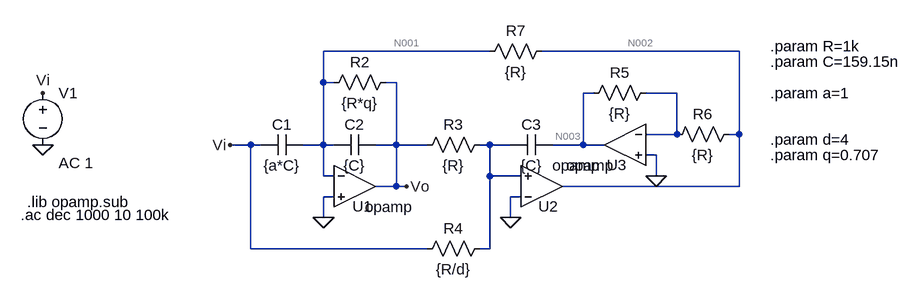
[diagram p0: schematic notch_ack.asc]
notch_ack.asc, the LTspice schematic file:
Version 4
SHEET 1 1316 680
WIRE 576 64 320 64
WIRE 960 64 656 64
WIRE 320 112 320 64
WIRE 336 112 320 112
WIRE 432 112 416 112
WIRE 736 128 720 128
WIRE 864 128 816 128
WIRE 864 192 864 128
WIRE 864 192 816 192
WIRE 960 192 960 64
WIRE 960 192 944 192
WIRE 208 208 176 208
WIRE 224 208 208 208
WIRE 320 208 320 112
WIRE 320 208 288 208
WIRE 336 208 320 208
WIRE 432 208 432 112
WIRE 432 208 400 208
WIRE 480 208 432 208
WIRE 576 208 560 208
WIRE 608 208 576 208
WIRE 720 208 720 128
WIRE 720 208 672 208
WIRE 752 208 720 208
WIRE 832 224 816 224
WIRE 320 256 320 208
WIRE 336 256 320 256
WIRE 576 256 576 208
WIRE 624 256 576 256
WIRE 832 256 832 224
WIRE 432 272 432 208
WIRE 432 272 400 272
WIRE 448 272 432 272
WIRE 960 272 960 192
WIRE 960 272 688 272
WIRE 336 288 320 288
WIRE 624 288 608 288
WIRE 320 320 320 288
WIRE 608 320 608 288
WIRE 208 368 208 208
WIRE 480 368 208 368
WIRE 576 368 576 256
WIRE 576 368 560 368
FLAG -112 128 Vi
FLAG -112 208 0
FLAG 176 208 Vi
FLAG 320 320 0
FLAG 608 320 0
FLAG 832 256 0
FLAG 448 272 Vo
SYMBOL voltage -112 112 R0
WINDOW 123 24 124 Left 2
WINDOW 39 0 0 Left 0
SYMATTR InstName V1
SYMATTR Value ""
SYMATTR Value2 AC 1
SYMBOL cap 288 192 R90
WINDOW 0 0 32 VBottom 2
WINDOW 3 32 32 VTop 2
SYMATTR InstName C1
SYMATTR Value {a*C}
SYMBOL OpAmps\\opamp 368 208 R0
WINDOW 0 -3 95 Left 2
SYMATTR InstName U1
SYMATTR SpiceLine Aol=1000K
SYMATTR SpiceLine2 GBW=100Meg
SYMBOL res 432 96 R90
WINDOW 0 0 56 VBottom 2
WINDOW 3 32 56 VTop 2
SYMATTR InstName R2
SYMATTR Value {R*q}
SYMBOL cap 400 192 R90
WINDOW 0 0 32 VBottom 2
WINDOW 3 32 32 VTop 2
SYMATTR InstName C2
SYMATTR Value {C}
SYMBOL res 576 192 R90
WINDOW 0 0 56 VBottom 2
WINDOW 3 32 56 VTop 2
SYMATTR InstName R3
SYMATTR Value {R}
SYMBOL res 576 352 R90
WINDOW 0 0 56 VBottom 2
WINDOW 3 32 56 VTop 2
SYMATTR InstName R4
SYMATTR Value {R/d}
SYMBOL OpAmps\\opamp 656 336 M180
WINDOW 0 -5 33 Left 2
SYMATTR InstName U2
SYMATTR SpiceLine Aol=1000K
SYMATTR SpiceLine2 GBW=100Meg
SYMBOL cap 672 192 R90
WINDOW 0 0 32 VBottom 2
WINDOW 3 32 32 VTop 2
SYMATTR InstName C3
SYMATTR Value {C}
SYMBOL OpAmps\\opamp 784 144 M0
WINDOW 0 -3 95 Left 2
SYMATTR InstName U3
SYMATTR SpiceLine Aol=1000K
SYMATTR SpiceLine2 GBW=100Meg
SYMBOL res 832 112 R90
WINDOW 0 0 56 VBottom 2
WINDOW 3 32 56 VTop 2
SYMATTR InstName R5
SYMATTR Value {R}
SYMBOL res 960 176 R90
WINDOW 0 0 56 VBottom 2
WINDOW 3 32 56 VTop 2
SYMATTR InstName R6
SYMATTR Value {R}
SYMBOL res 672 48 R90
WINDOW 0 0 56 VBottom 2
WINDOW 3 32 56 VTop 2
SYMATTR InstName R7
SYMATTR Value {R}
TEXT -136 296 Left 2 !.lib opamp.sub
TEXT -146 316 Left 2 !.ac dec 1000 10 100k
TEXT 1008 56 Left 2 !.param R=1k
TEXT 1008 80 Left 2 !.param C=159.15n
TEXT 1008 128 Left 2 !.param a=1
TEXT 1008 200 Left 2 !.param d=4
TEXT 1008 224 Left 2 !.param q=0.707

The netlist it stands for:
* notch_ack.asc
V1 Vi 0 AC 1
C1 N001 Vi {a*C}
XU1 N001 0 Vo opamp Aol=1000K GBW=100Meg  ; pins invin noninvin out
R2 Vo N001 {R*q}
C2 Vo N001 {C}
R3 N005 Vo {R}
R4 N005 Vi {R/d}
XU2 0 N005 N002 opamp Aol=1000K GBW=100Meg  ; pins invin noninvin out
C3 N003 N005 {C}
XU3 N004 0 N003 opamp Aol=1000K GBW=100Meg  ; pins invin noninvin out
R5 N004 N003 {R}
R6 N002 N004 {R}
R7 N002 N001 {R}
.lib opamp.sub
.ac dec 1000 10 100k
.param R=1k
.param C=159.15n
.param a=1
.param d=4
.param q=0.707
.backanno
.end

* Results of the author's LTspice run, read from the files saved beside the schematic
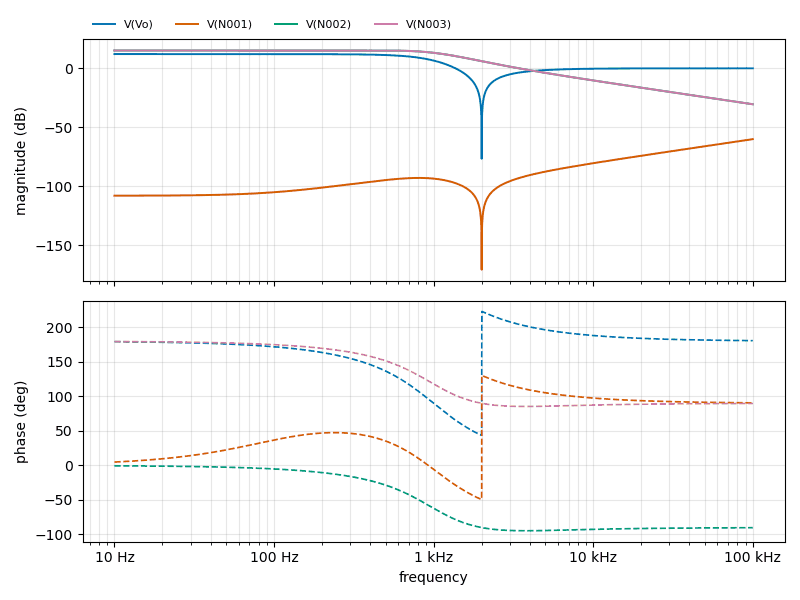
[diagram p1: AC Analysis of notch_ack.asc, plotted from the saved traces]
* AC Analysis, 1 run:
*   V(Vo): 12.04 dB at 10 Hz, -0.00 dB at 100 kHz, peak 12.04 dB at 10 Hz, 3 dB below the peak at 800.4 Hz
*   V(N001): -107.90 dB at 10 Hz, -60.00 dB at 100 kHz, peak -60.00 dB at 100 kHz, 3 dB below the peak at 70.74 kHz
*   V(N002): 15.05 dB at 10 Hz, -30.46 dB at 100 kHz, peak 15.14 dB at 370.7 Hz, 3 dB below the peak at 1.138 kHz
*   V(N003): 15.05 dB at 10 Hz, -30.46 dB at 100 kHz, peak 15.14 dB at 370.7 Hz, 3 dB below the peak at 1.138 kHz